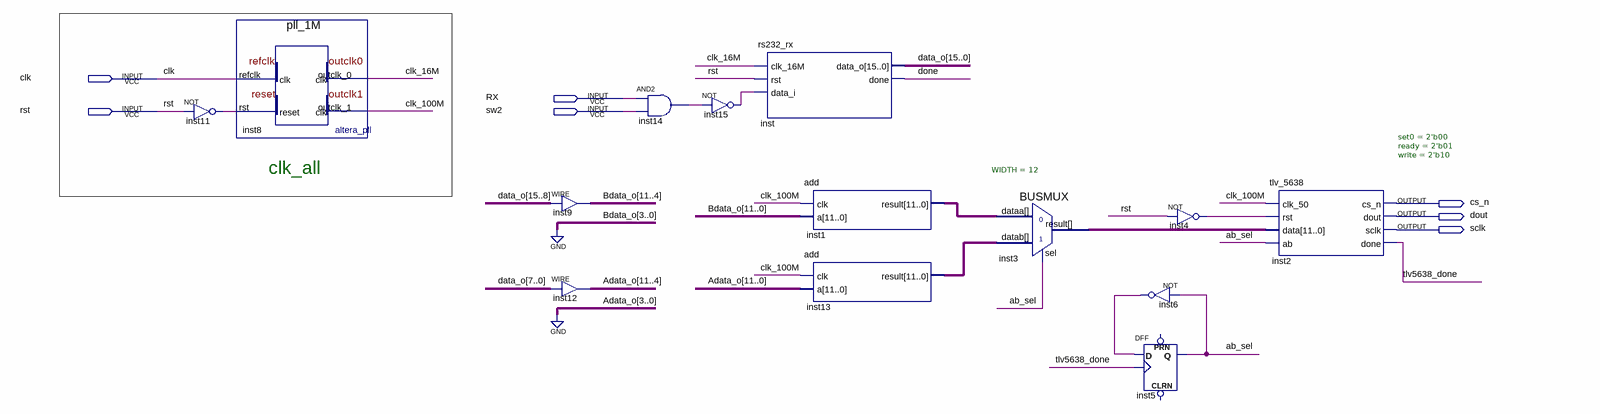
[diagram p0: schematic sheet]
// Quartus schematic psk.bdf as structural Verilog: 14 symbols, 7 pins
module psk (
  input  clk,
  input  RX,
  input  rst,
  input  sw2,
  output cs_n,
  output dout,
  output sclk
);

  wire ab_sel, clk_16M, clk_100M, done, inst4_out, inst6_out, inst11_out, inst14_out, inst15_out,
       tlv5638_done;
  wire [11:0] inst1_result, inst3_result, inst13_result;
  wire [11:4] Adata_o, Bdata_o;
  wire [15:0] data_o;

  not inst11 (inst11_out, rst);
  pll_1M inst8 (.refclk(clk), .rst(inst11_out), .outclk_0(clk_16M), .outclk_1(clk_100M));
  assign Bdata_o = data_o[15:8];  // WIRE inst9
  assign Adata_o = data_o[7:0];  // WIRE inst12
  and inst14 (inst14_out, RX, sw2);
  not inst15 (inst15_out, inst14_out);
  rs232_rx inst (.clk_16M(clk_16M), .rst(rst), .data_i(inst15_out), .data_o(data_o), .done(done));
  add inst1 (.clk(clk_100M), .a({Bdata_o, 4'b0000}), .result(inst1_result));
  add inst13 (.clk(clk_100M), .a({Adata_o, 4'b0000}), .result(inst13_result));
  BUSMUX #(.WIDTH(12)) inst3 (.datab(inst13_result), .sel(ab_sel), .dataa(inst1_result), .result(inst3_result));
  not inst6 (inst6_out, ab_sel);
  DFF inst5 (.CLK(tlv5638_done), .D(inst6_out), .Q(ab_sel));  // open: CLRN, PRN
  not inst4 (inst4_out, rst);
  tlv_5638 #(.set0(2'b00), .ready(2'b01), .write(2'b10)) inst2 (
    .clk_50(clk_100M), .rst(inst4_out), .data(inst3_result), .ab(ab_sel), .cs_n(cs_n), .dout(dout),
    .sclk(sclk), .done(tlv5638_done));

  // Notes on the sheet:
  //   clk_all
endmodule
